# Altium schematic sheet MC21R01_uC_GPIO.SchDoc: MC21R01 Top Level
size A3; Author: AMP; DrawnBy: AMP; Organization: Altium Limited; Address1: 3 Minna Close; Address2: Belrose; Address3: NSW 2085; Address4: Australia; DocumentNumber: 0; Revision: 1.0; SheetNumber: 0; SheetTotal: 0
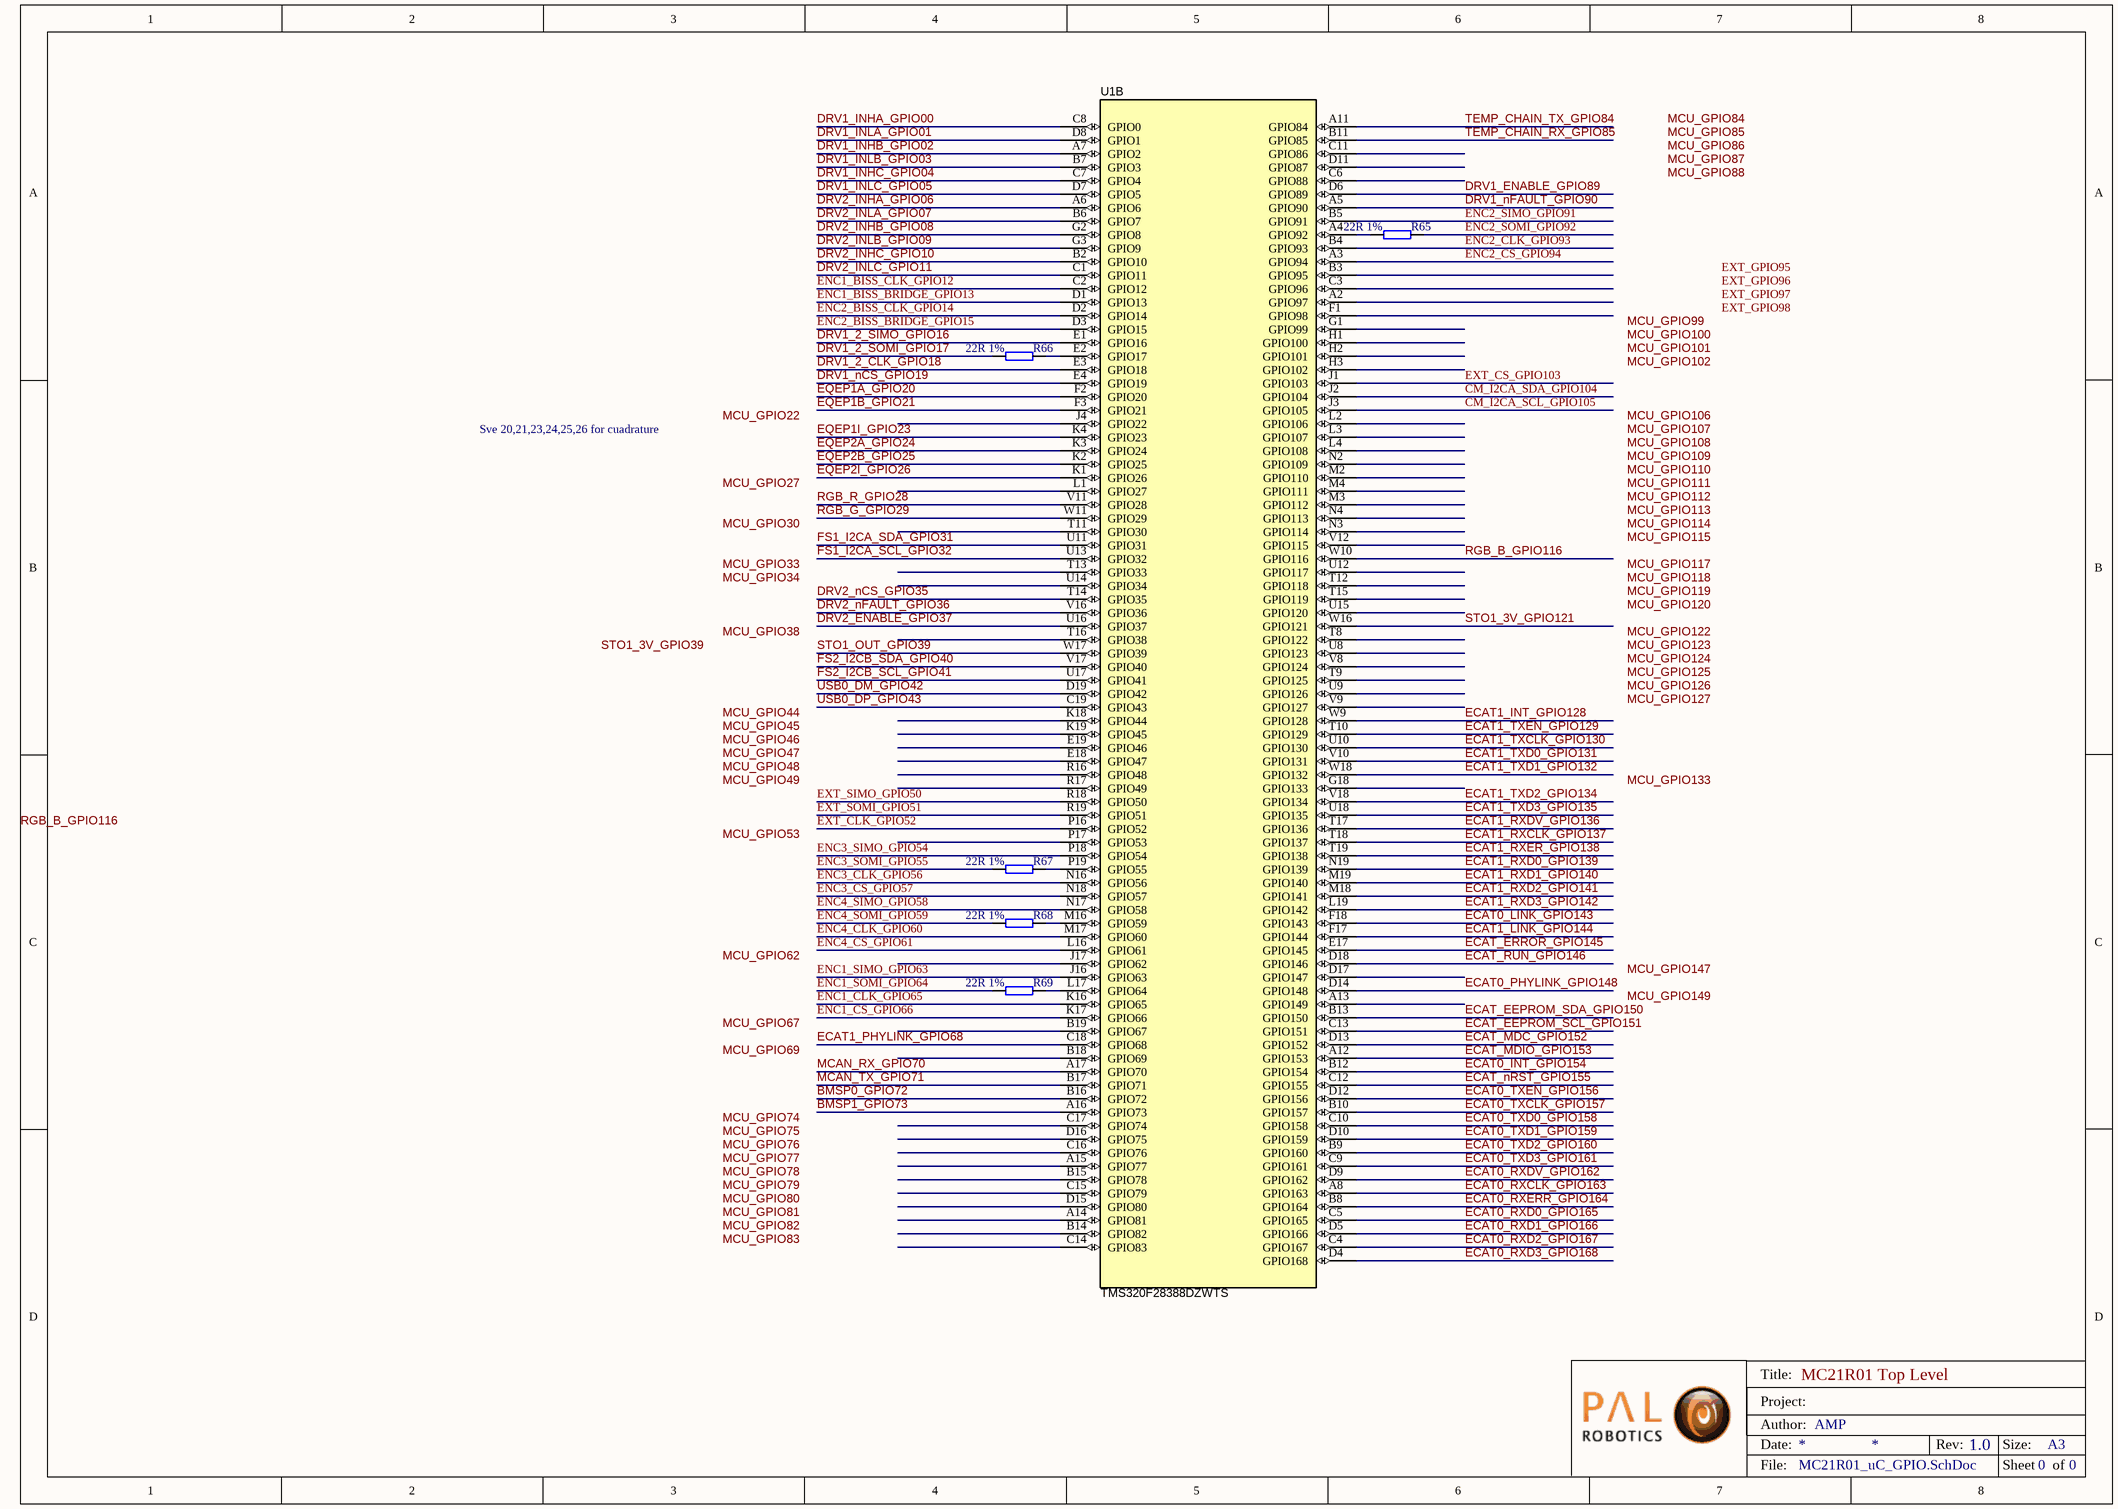
[diagram p0: MC21R01_uC_GPIO.SchDoc]

## Parts
R65  22R 1%  [0402 SMD rESISTOR]
R66  22R 1%  [0402 SMD rESISTOR]
R67  22R 1%  [0402 SMD rESISTOR]
R68  22R 1%  [0402 SMD rESISTOR]
R69  22R 1%  [0402 SMD rESISTOR]
U1  TMS320F28388DZWTS  [ZWT0337A]  (part B of 5)

## Nets
BMSP0_GPIO72: U1.B16(GPIO72)
BMSP1_GPIO73: U1.A16(GPIO73)
CM_I2CA_SCL_GPIO105: U1.J3(GPIO105)
CM_I2CA_SDA_GPIO104: U1.J2(GPIO104)
DRV1_2_CLK_GPIO18: U1.E3(GPIO18)
DRV1_2_SIMO_GPIO16: U1.E1(GPIO16)
DRV1_2_SOMI_GPIO17: R66.2
DRV1_ENABLE_GPIO89: U1.D6(GPIO89)
DRV1_INHA_GPIO00: U1.C8(GPIO0)
DRV1_INHB_GPIO02: U1.A7(GPIO2)
DRV1_INHC_GPIO04: U1.C7(GPIO4)
DRV1_INLA_GPIO01: U1.D8(GPIO1)
DRV1_INLB_GPIO03: U1.B7(GPIO3)
DRV1_INLC_GPIO05: U1.D7(GPIO5)
DRV1_nCS_GPIO19: U1.E4(GPIO19)
DRV1_nFAULT_GPIO90: U1.A5(GPIO90)
DRV2_ENABLE_GPIO37: U1.U16(GPIO37)
DRV2_INHA_GPIO06: U1.A6(GPIO6)
DRV2_INHB_GPIO08: U1.G2(GPIO8)
DRV2_INHC_GPIO10: U1.B2(GPIO10)
DRV2_INLA_GPIO07: U1.B6(GPIO7)
DRV2_INLB_GPIO09: U1.G3(GPIO9)
DRV2_INLC_GPIO11: U1.C1(GPIO11)
DRV2_nCS_GPIO35: U1.T14(GPIO35)
DRV2_nFAULT_GPIO36: U1.V16(GPIO36)
ECAT0_INT_GPIO154: U1.B12(GPIO154)
ECAT0_LINK_GPIO143: U1.F18(GPIO143)
ECAT0_PHYLINK_GPIO148: U1.D14(GPIO148)
ECAT0_RXCLK_GPIO163: U1.A8(GPIO163)
ECAT0_RXD0_GPIO165: U1.C5(GPIO165)
ECAT0_RXD1_GPIO166: U1.D5(GPIO166)
ECAT0_RXD2_GPIO167: U1.C4(GPIO167)
ECAT0_RXD3_GPIO168: U1.D4(GPIO168)
ECAT0_RXDV_GPIO162: U1.D9(GPIO162)
ECAT0_RXERR_GPIO164: U1.B8(GPIO164)
ECAT0_TXCLK_GPIO157: U1.B10(GPIO157)
ECAT0_TXD0_GPIO158: U1.C10(GPIO158)
ECAT0_TXD1_GPIO159: U1.D10(GPIO159)
ECAT0_TXD2_GPIO160: U1.B9(GPIO160)
ECAT0_TXD3_GPIO161: U1.C9(GPIO161)
ECAT0_TXEN_GPIO156: U1.D12(GPIO156)
ECAT1_INT_GPIO128: U1.W9(GPIO128)
ECAT1_LINK_GPIO144: U1.F17(GPIO144)
ECAT1_PHYLINK_GPIO68: U1.C18(GPIO68)
ECAT1_RXCLK_GPIO137: U1.T18(GPIO137)
ECAT1_RXD0_GPIO139: U1.N19(GPIO139)
ECAT1_RXD1_GPIO140: U1.M19(GPIO140)
ECAT1_RXD2_GPIO141: U1.M18(GPIO141)
ECAT1_RXD3_GPIO142: U1.L19(GPIO142)
ECAT1_RXDV_GPIO136: U1.T17(GPIO136)
ECAT1_RXER_GPIO138: U1.T19(GPIO138)
ECAT1_TXCLK_GPIO130: U1.U10(GPIO130)
ECAT1_TXD0_GPIO131: U1.V10(GPIO131)
ECAT1_TXD1_GPIO132: U1.W18(GPIO132)
ECAT1_TXD2_GPIO134: U1.V18(GPIO134)
ECAT1_TXD3_GPIO135: U1.U18(GPIO135)
ECAT1_TXEN_GPIO129: U1.T10(GPIO129)
ECAT_EEPROM_SCL_GPIO151: U1.C13(GPIO151)
ECAT_EEPROM_SDA_GPIO150: U1.B13(GPIO150)
ECAT_ERROR_GPIO145: U1.E17(GPIO145)
ECAT_MDC_GPIO152: U1.D13(GPIO152)
ECAT_MDIO_GPIO153: U1.A12(GPIO153)
ECAT_nRST_GPIO155: U1.C12(GPIO155)
ECAT_RUN_GPIO146: U1.D18(GPIO146)
ENC1_BISS_BRIDGE_GPIO13: U1.D1(GPIO13)
ENC1_BISS_CLK_GPIO12: U1.C2(GPIO12)
ENC1_CLK_GPIO65: U1.K16(GPIO65)
ENC1_CS_GPIO66: U1.K17(GPIO66)
ENC1_SIMO_GPIO63: U1.J16(GPIO63)
ENC1_SOMI_GPIO64: R69.2
ENC2_BISS_BRIDGE_GPIO15: U1.D3(GPIO15)
ENC2_BISS_CLK_GPIO14: U1.D2(GPIO14)
ENC2_CLK_GPIO93: U1.B4(GPIO93)
ENC2_CS_GPIO94: U1.A3(GPIO94)
ENC2_SIMO_GPIO91: U1.B5(GPIO91)
ENC2_SOMI_GPIO92: R65.1
ENC3_CLK_GPIO56: U1.N16(GPIO56)
ENC3_CS_GPIO57: U1.N18(GPIO57)
ENC3_SIMO_GPIO54: U1.P18(GPIO54)
ENC3_SOMI_GPIO55: R67.2
ENC4_CLK_GPIO60: U1.M17(GPIO60)
ENC4_CS_GPIO61: U1.L16(GPIO61)
ENC4_SIMO_GPIO58: U1.N17(GPIO58)
ENC4_SOMI_GPIO59: R68.2
EQEP1A_GPIO20: U1.F2(GPIO20)
EQEP1B_GPIO21: U1.F3(GPIO21)
EQEP1I_GPIO23: U1.K4(GPIO23)
EQEP2A_GPIO24: U1.K3(GPIO24)
EQEP2B_GPIO25: U1.K2(GPIO25)
EQEP2I_GPIO26: U1.K1(GPIO26)
EXT_CLK_GPIO52: U1.P16(GPIO52)
EXT_CS_GPIO103: U1.J1(GPIO103)
EXT_SIMO_GPIO50: U1.R18(GPIO50)
EXT_SOMI_GPIO51: U1.R19(GPIO51)
FS1_I2CA_SCL_GPIO32: U1.U13(GPIO32)
FS1_I2CA_SDA_GPIO31: U1.U11(GPIO31)
FS2_I2CB_SCL_GPIO41: U1.U17(GPIO41)
FS2_I2CB_SDA_GPIO40: U1.V17(GPIO40)
MCAN_RX_GPIO70: U1.A17(GPIO70)
MCAN_TX_GPIO71: U1.B17(GPIO71)
RGB_B_GPIO116: U1.W10(GPIO116)
RGB_G_GPIO29: U1.W11(GPIO29)
RGB_R_GPIO28: U1.V11(GPIO28)
STO1_3V_GPIO121: U1.W16(GPIO121)
STO1_OUT_GPIO39: U1.W17(GPIO39)
TEMP_CHAIN_RX_GPIO85: U1.B11(GPIO85)
TEMP_CHAIN_TX_GPIO84: U1.A11(GPIO84)
USB0_DM_GPIO42: U1.D19(GPIO42)
USB0_DP_GPIO43: U1.C19(GPIO43)
NetR65_2: R65.2 U1.A4(GPIO92)
NetR66_1: R66.1 U1.E2(GPIO17)
NetR67_1: R67.1 U1.P19(GPIO55)
NetR68_1: R68.1 U1.M16(GPIO59)
NetR69_1: R69.1 U1.L17(GPIO64)

Not connected (* = marked no-connect by the designer): U1 A2(GPIO97) A13(GPIO149) A14(GPIO81) A15(GPIO77) B3(GPIO95) B14(GPIO82) B15(GPIO78) B18(GPIO69) B19(GPIO67) C3(GPIO96) C6(GPIO88) C11(GPIO86) C14(GPIO83) C15(GPIO79) C16(GPIO76) C17(GPIO74) D11(GPIO87) D15(GPIO80) D16(GPIO75) D17(GPIO147) E18(GPIO47) E19(GPIO46) F1(GPIO98) G1(GPIO99) G18(GPIO133) H1(GPIO100) H2(GPIO101) H3(GPIO102) J4(GPIO22) J17(GPIO62) K18(GPIO44) K19(GPIO45) L1(GPIO27) L2(GPIO106) L3(GPIO107) L4(GPIO108) M2(GPIO110) M3(GPIO112) M4(GPIO111) N2(GPIO109) N3(GPIO114) N4(GPIO113) P17(GPIO53) R16(GPIO48) R17(GPIO49) T8(GPIO122) T9(GPIO125) T11(GPIO30) T12(GPIO118) T13(GPIO33) T15(GPIO119) T16(GPIO38) U8(GPIO123) U9(GPIO126) U12(GPIO117) U14(GPIO34) U15(GPIO120) V8(GPIO124) V9(GPIO127) V12(GPIO115)

## Notes on the sheet
- Sve 20,21,23,24,25,26 for cuadrature
- Title:
- Date:
- Project:
- Author:
- Rev:
- Size:
- A3
- File:
- Sheet
- of
- Labels drawn without touching a wire or pin: EXT_GPIO95, EXT_GPIO96, EXT_GPIO97, EXT_GPIO98, MCU_GPIO22, MCU_GPIO27, MCU_GPIO30, MCU_GPIO33, MCU_GPIO34, MCU_GPIO38, MCU_GPIO44, MCU_GPIO45, MCU_GPIO46, MCU_GPIO47, MCU_GPIO48, MCU_GPIO49, MCU_GPIO53, MCU_GPIO62, MCU_GPIO67, MCU_GPIO69, MCU_GPIO74, MCU_GPIO75, MCU_GPIO76, MCU_GPIO77, MCU_GPIO78, MCU_GPIO79, MCU_GPIO80, MCU_GPIO81, MCU_GPIO82, MCU_GPIO83, MCU_GPIO84, MCU_GPIO85, MCU_GPIO86, MCU_GPIO87, MCU_GPIO88, MCU_GPIO99, MCU_GPIO100, MCU_GPIO101, MCU_GPIO102, MCU_GPIO106, MCU_GPIO107, MCU_GPIO108, MCU_GPIO109, MCU_GPIO110, MCU_GPIO111, MCU_GPIO112, MCU_GPIO113, MCU_GPIO114, MCU_GPIO115, MCU_GPIO117, MCU_GPIO118, MCU_GPIO119, MCU_GPIO120, MCU_GPIO122, MCU_GPIO123, MCU_GPIO124, MCU_GPIO125, MCU_GPIO126, MCU_GPIO127, MCU_GPIO133, MCU_GPIO147, MCU_GPIO149, RGB_B_GPIO116, STO1_3V_GPIO39

## Library data of the parts
R65-R69 = 22R/50V 1% 0402 63mW: 22R/50V 1% 0402 63mW SMD Resistor; Manufacturer 1: Vishay; Manufacturer Part Number 1: CRCW040222R0FKED; Supplier 1: Farnell; Supplier Part Number 1: 1469697; Value: 22R
U1 = TMS320F28388: TMS320F28388DZWTS, ZWT0337A (NFBGA-337); Manufacturer: Texas Instruments; SizeAreaWB_mm2: 324; SizeArea_mm2: 256; AEC Qualified: N; AEC Category: Q200; SizeZ_mm: 1.4; SizeY_mm: 16; CompType: IC; ComponentLink1Description: Datasheet Link; ComponentLink2Description: Product Folder; PackageReference: ZWT0337A; PackageDescription: NFBGA-337; ComponentLink2URL: http://www.ti.com/product/tms320f28388d; Alternate Manufacturer: Texas Instruments; ComponentLink3URL: http://www.ti.com/product/tms320f28388d/datasheet; ComponentLink1URL: http://www.ti.com/lit/ds/symlink/tms320f28388d.pdf; MountType: SMT; ComponentLink3Description: Online Datasheet; SizeX_mm: 16; PartNumber: TMS320F28388DZWTS